# EAGLE schematic Squirco Logic v1.0 (EAGLE 6.5.0)
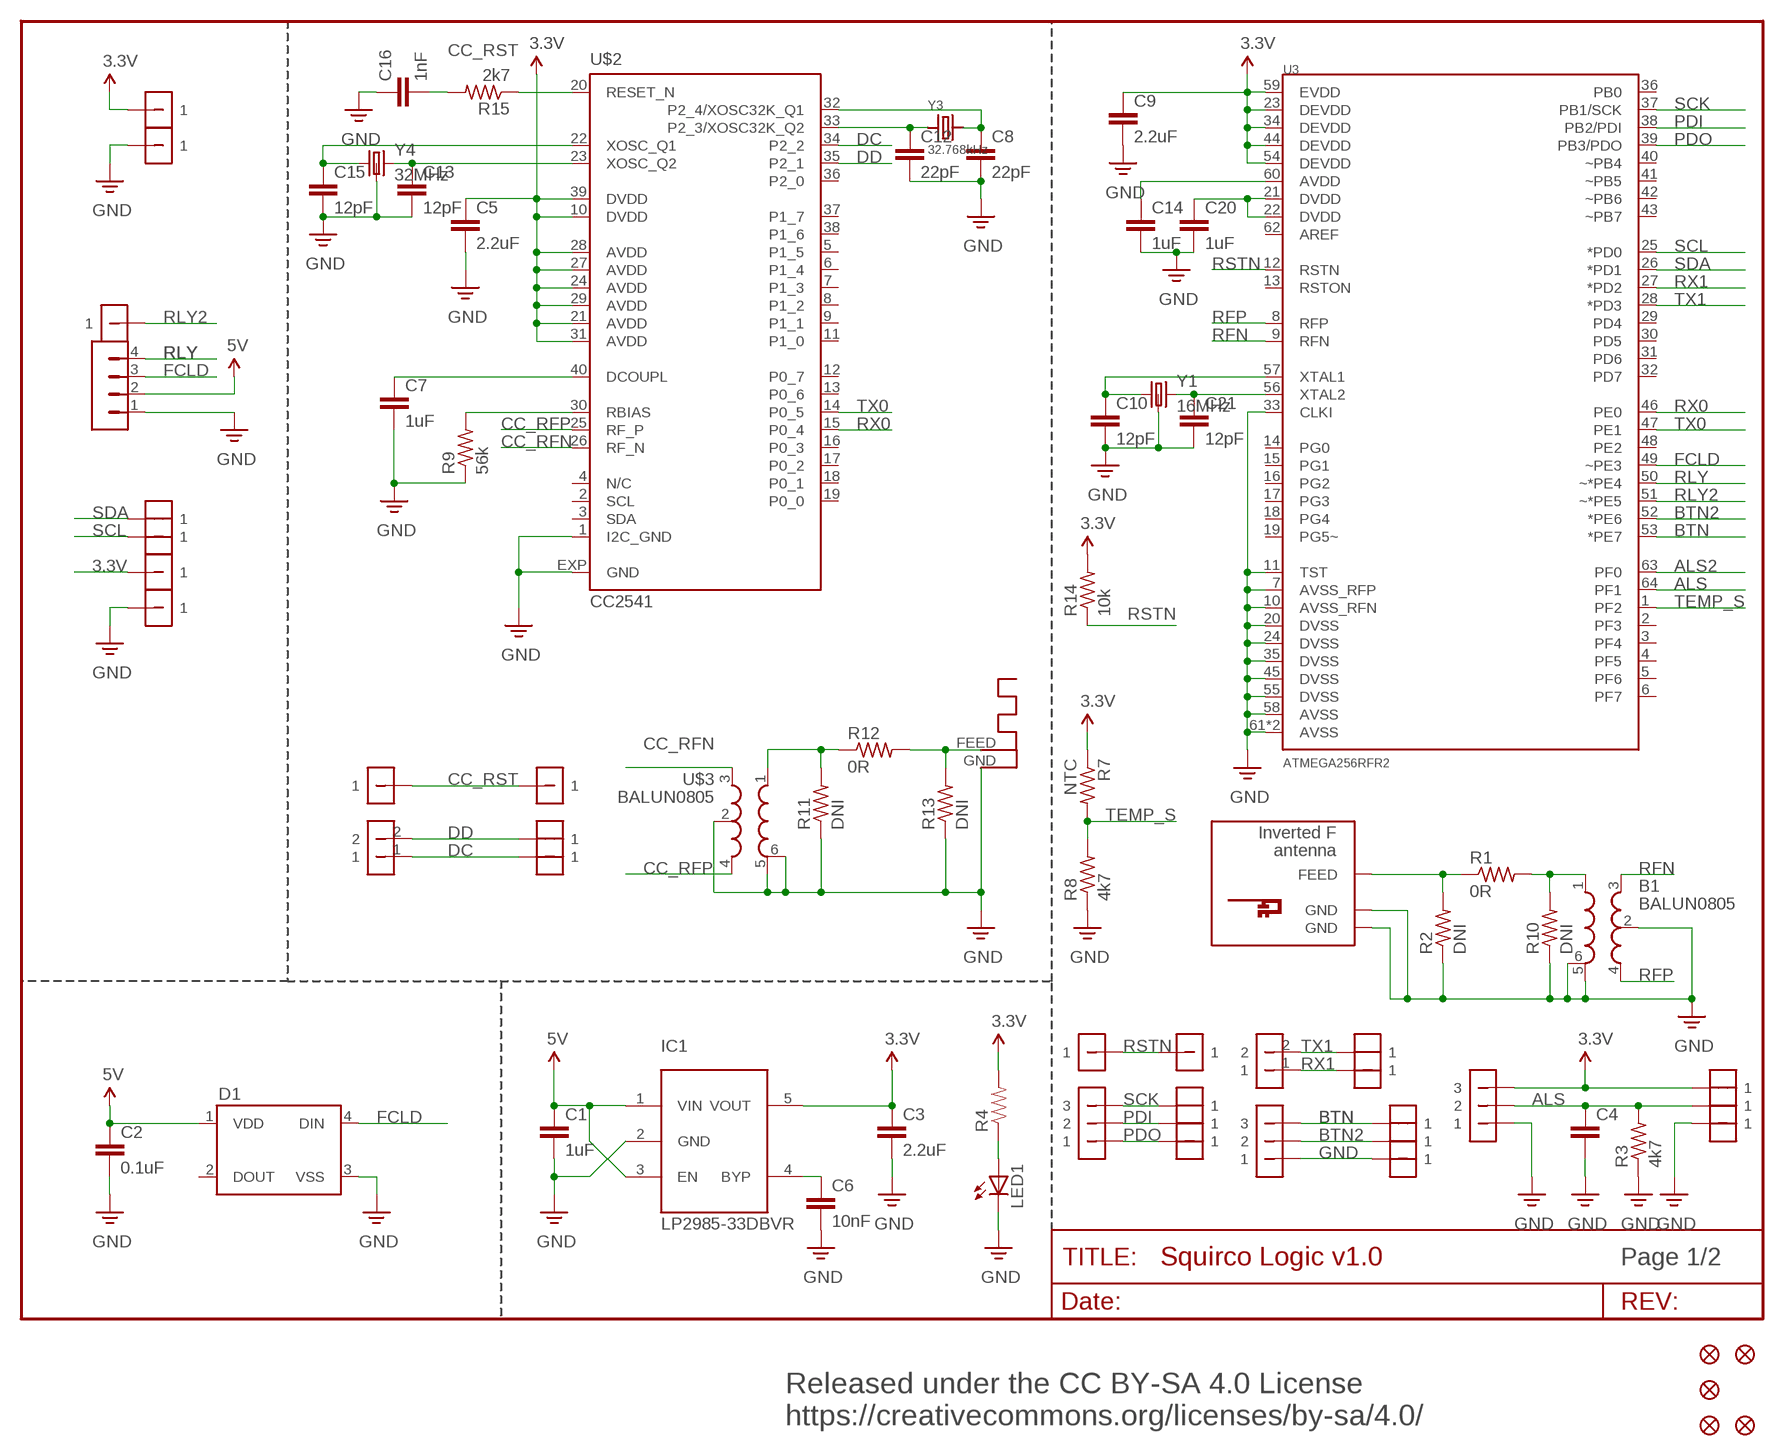
[diagram p0: schematic, sheet 1]

## Parts
ANT1  ANTENNA  [RN-ANT]
B1  BALUN0805  [BALUN-2-4GHZ]
C1  1uF  CAP0603-CAP  [0603-CAP]
C2  0.1uF  CAP0603-CAP  [0603-CAP]
C3  2.2uF  CAP0603-CAP  [0603-CAP]
C4  CAP0603-CAP  [0603-CAP]
C5  2.2uF  CAP0603-CAP  [0603-CAP]
C6  10nF  CAP0603-CAP  [0603-CAP]
C7  1uF  CAP0603-CAP  [0603-CAP]
C8  22pF  CAP0402-CAP  [0402-CAP]
C9  2.2uF  CAP0603-CAP  [0603-CAP]
C10  12pF  CAP0402-CAP  [0402-CAP]
C12  22pF  CAP0402-CAP  [0402-CAP]
C13  12pF  CAP0402-CAP  [0402-CAP]
C14  1uF  CAP0603-CAP  [0603-CAP]
C15  12pF  CAP0402-CAP  [0402-CAP]
C16  1nF  CAP0603-CAP  [0603-CAP]
C20  1uF  CAP0603-CAP  [0603-CAP]
C21  12pF  CAP0402-CAP  [0402-CAP]
D1  WS2812B  [WS2812B]
FID1  FIDUCIALUFIDUCIAL  [MICRO-FIDUCIAL]
FID2  FIDUCIALUFIDUCIAL  [MICRO-FIDUCIAL]
FID3  FIDUCIALUFIDUCIAL  [MICRO-FIDUCIAL]
FID5  FIDUCIALUFIDUCIAL  [MICRO-FIDUCIAL]
FID6  FIDUCIALUFIDUCIAL  [MICRO-FIDUCIAL]
IC1  LP2985-33DBVR  LP298XS  [SOT23-5L]
JP1  M02  [M02]
LED1  LEDCHIP-LED0805  [CHIP-LED0805]
R1  0R  R-US_R0402  [R0402]
R2  DNI  R-US_R0402  [R0402]
R3  4k7  R-US_R0603  [R0603]
R4  RESISTOR0603  [0603-RES]
R7  NTC  R-US_R0402  [R0402]
R8  4k7  R-US_R0603  [R0603]
R9  56k  R-US_R0603  [R0603]
R10  DNI  R-US_R0402  [R0402]
R11  DNI  R-US_R0402  [R0402]
R12  0R  R-US_R0402  [R0402]
R13  DNI  R-US_R0402  [R0402]
R14  10k  R-US_R0603  [R0603]
R15  2k7  R-US_R0603  [R0603]
U3  ATMEGA256RFR2  [QFN-64]
U$1  INVERTED_F_ANTENNA+5  [DN007+5]
U$2  CC2541  [RHA_S-PVQFN-N40]
U$3  BALUN0805  [BALUN-2-4GHZ]
U$4  M03  [M03]
U$5  S04-4MM  [S04-4MM]
U$6  M03  [M03]
U$7  M01  [M01]
U$8  M01  [M01]
U$9  M02  [M02]
U$10  S01C-4MM  [S01C-4MM]
U$11  S01C-4MM  [S01C-4MM]
U$12  S01C-4MM  [S01C-4MM]
U$13  S01C-4MM  [S01C-4MM]
U$14  S01C-4MM  [S01C-4MM]
U$15  S01C-4MM  [S01C-4MM]
U$16  S01C-4MM  [S01C-4MM]
U$17  S01C-4MM  [S01C-4MM]
U$18  S01C-4MM  [S01C-4MM]
U$19  S01C-4MM  [S01C-4MM]
U$20  S01C-4MM  [S01C-4MM]
U$21  S01C-4MM  [S01C-4MM]
U$22  S01C-4MM  [S01C-4MM]
U$23  S01C-4MM  [S01C-4MM]
U$24  S01C-4MM  [S01C-4MM]
U$25  M03  [M03]
U$26  S01C-4MM  [S01C-4MM]
U$27  S01C-4MM  [S01C-4MM]
U$30  S01C-4MM  [S01C-4MM]
U$31  S01C-4MM  [S01C-4MM]
U$32  S01-4MM  [S01-4MM]
U$33  S01-4MM  [S01-4MM]
U$34  S01C-4MM  [S01C-4MM]
Y1  16MHz  CRYSTALABM10  [CRYSTAL-SMD-2.5X2-ABM10]
Y3  32.768kHz  CRYSTAL.ABS07  [ABS07]
Y4  32MHz  CRYSTALABM10  [CRYSTAL-SMD-2.5X2-ABM10]

## Nets
3.3V: C3.1 C5.1 C9.1 IC1.5(VOUT) R4.2 R7.1 R14.2 U3.23(DEVDD) U3.34(DEVDD) U3.44(DEVDD) U3.54(DEVDD) U3.59(EVDD) U$2.10(DVDD) U$2.21(AVDD) U$2.24(AVDD) U$2.27(AVDD) U$2.28(AVDD) U$2.29(AVDD) U$2.31(AVDD) U$2.39(DVDD) U$20.P$1 U$25.3 U$26.P$1 U$30.P$1
5V: C1.1 C2.1 D1.1(VDD) IC1.1(VIN) IC1.3(EN) U$5.2
ALS: C4.1 R3.2 U3.64(PF1) U$25.2 U$31.P$1
ALS2: U3.63(PF0)
BTN: U3.53(*PE7) U$6.3 U$22.P$1
BTN2: U3.52(*PE6) U$6.2 U$23.P$1
CC_RFN: U$2.26(RF_N) U$3.3
CC_RFP: U$2.25(RF_P) U$3.4
CC_RST: C16.2 R15.2 U$8.1 U$17.P$1
DC: U$2.34(P2_2) U$9.1 U$19.P$1
DD: U$2.35(P2_1) U$9.2 U$18.P$1
FCLD: D1.4(DIN) U3.49(~PE3) U$5.3
GND: ANT1.GND B1.2 B1.5 B1.6 C1.2 C2.2 C3.2 C4.2 C5.2 C6.2 C7.2 C8.2 C9.2 C10.2 C12.2 C13.2 C14.2 C15.2 C16.1 C20.2 C21.2 D1.3(VSS) IC1.2(GND) LED1.C R2.1 R3.1 R8.1 R9.1 R10.1 R11.1 R13.1 U3.7(AVSS_RFP) U3.10(AVSS_RFN) U3.11(TST) U3.20(DVSS) U3.24(DVSS) U3.33(CLKI) U3.35(DVSS) U3.45(DVSS) U3.55(DVSS) U3.58(AVSS) U3.61(AVSS) U3.PADDLE(AVSS) U$1.GND U$1.GND@1(GND) U$2.1(I2C_GND) U$2.EXP(GND) U$3.2 U$3.5 U$3.6 U$5.1 U$6.1 U$21.P$1 U$25.1 U$27.P$1 U$32.P$1 U$33.P$1 Y1.P$2(GND) Y1.P$4(GND) Y4.P$2(GND) Y4.P$4(GND)
N$1: C10.1 U3.57(XTAL1) Y1.P$1
N$2: C21.1 U3.56(XTAL2) Y1.P$3
N$3: LED1.A R4.1
N$5: R1.1 R2.2 U$1.FEED
N$6: C6.1 IC1.4(BYP)
N$7: C7.1 U$2.40(DCOUPL)
N$8: C20.1 U3.21(DVDD) U3.22(DVDD)
N$9: C14.1 U3.60(AVDD)
N$11: R9.2 U$2.30(RBIAS)
N$14: R11.2 R12.1 U$3.1
N$15: ANT1.FEED R12.2 R13.2
N$16: C15.1 U$2.22(XOSC_Q1) Y4.P$1
N$18: C13.1 U$2.23(XOSC_Q2) Y4.P$3
N$19: C8.1 U$2.32(P2_4/XOSC32K_Q1) Y3.2
N$20: B1.1 R1.2 R10.2
N$21: C12.1 U$2.33(P2_3/XOSC32K_Q2) Y3.1
N$24: R15.1 U$2.20(RESET_N)
PDI: U3.38(PB2/PDI) U$4.2 U$13.P$1
PDO: U3.39(PB3/PDO) U$4.1 U$14.P$1
RFN: B1.3 U3.9(RFN)
RFP: B1.4 U3.8(RFP)
RLY: U3.50(~*PE4) U$5.4
RLY2: U3.51(~*PE5) U$34.P$1
RSTN: R14.1 U3.12(RSTN) U$7.1 U$11.P$1
RX0: U3.46(PE0) U$2.15(P0_4)
RX1: JP1.1 U3.27(*PD2) U$16.P$1
SCK: U3.37(PB1/SCK) U$4.3 U$12.P$1
SCL: U3.25(*PD0) U$24.P$1
SDA: U3.26(*PD1) U$10.P$1
TEMP_S: R7.2 R8.2 U3.1(PF2)
TX0: U3.47(PE1) U$2.14(P0_5)
TX1: JP1.2 U3.28(*PD3) U$15.P$1
Unconnected: D1.2(DOUT) U3.2(PF3) U3.3(PF4) U3.4(PF5) U3.5(PF6) U3.6(PF7) U3.13(RSTON) U3.14(PG0) U3.15(PG1) U3.16(PG2) U3.17(PG3) U3.18(PG4) U3.19(PG5~) U3.29(PD4) U3.30(PD5) U3.31(PD6) U3.32(PD7) U3.36(PB0) U3.40(~PB4) U3.41(~PB5) U3.42(~PB6) U3.43(~PB7) U3.48(PE2) U3.62(AREF) U$2.2(SCL) U$2.3(SDA) U$2.5(P1_5) U$2.6(P1_4) U$2.7(P1_3) U$2.8(P1_2) U$2.9(P1_1) U$2.11(P1_0) U$2.12(P0_7) U$2.13(P0_6) U$2.16(P0_3) U$2.17(P0_2) U$2.18(P0_1) U$2.19(P0_0) U$2.36(P2_0) U$2.37(P1_7) U$2.38(P1_6)

## Notes on the sheet
- Page 1/2
- Released under the CC BY-SA 4.0 License
  https://creativecommons.org/licenses/by-sa/4.0/

## Power pins joined to a net without a drawn wire
N/C: U$2.4(N/C)

## Library data of the parts
ANT1 = adafruit:ANTENNA
B1 U$3 = Pinoccio2:BALUN: Johanson 2450BM15A001
C1-C10 C12-C16 C20 C21 = SparkFun-Capacitors:CAP: Capacitor Standard 0603 ceramic capacitor, and 0.1" leaded capacitor.
D1 = SparkFun-LED:WS2812B: WS2812B - Intelligent control LED integrated light source Technical Specifications: Power Supply Voltage (VDD): 3.5 to 5.3 V Input Voltage (VI): -0.5 to VDD+0.5 V Operating Junction Temperature (Topt): -25°C to +80°C Storage Temperature Range (Tstg): -55°C to +150°C
FID1-FID3 FID5 FID6 = SparkFun-Aesthetics:FIDUCIAL: Fiducial Alignment Points Various fiducial points for machine vision alignment.
IC1 = adafruit:LP298X
JP1 U$9 = pinhead-half:M02
LED1 = adafruit:LED: LED OSRAM: - CHIPLED LG R971, LG N971, LY N971, LG Q971, LY Q971, LO R971, LY R971 LH N974, LH R974 LS Q976, LO Q976, LY Q976 LO Q996 - Hyper CHIPLED LW Q18S LB Q993, LB Q99A, LB R99A - SideLED LS A670, LO A670, LY A670, LG A670, LP A670 LB A673, LV A673, LT A673, LW A673 LH A674 LY A675 LS A676, LA A676, LO A676, LY A676, LW A676 LS A679, LY A679, LG A679 - Hyper Micro SIDELED® LS Y876, LA Y876, LO Y876, LY Y876 LT Y87S - SmartLED LW L88C, LW L88S LB L89C, LB L89S, LG L890 LS L89K, LO L89K, LY L89K LS L896, LA L896, LO L896, LY L896 - TOPLED LS T670, LO T670, LY T670, LG T670, LP T670 LSG T670, LSP T670, LSY T670, LOP T670, LYG T670 LG T671, LOG T671, LSG T671 LB T673, LV T673, LT T673, LW T673 LH T674 LS T676, LA T676, LO T676, LY T676, LB T676, LH T676, LSB T676, LW T676 LB T67C, LV T67C, LT T67C, LS T67K, LO T67K, LY T67K, LW E67C LS E67B, LA E67B, LO E67B, LY E67B, LB E67C, LV E67C, LT E67C LW T67C LS T679, LY T679, LG T679 LS T770, LO T770, LY T770, LG T770, LP T770 LB T773, LV T773, LT T773, LW T773 LH T774 LS E675, LA E675, LY E675, LS T675 LS T776, LA T776, LO T776, LY T776, LB T776 LHGB T686 LT T68C, LB T68C - Hyper Mini TOPLED® LB M676 - Mini TOPLED Santana® LG M470 LS M47K, LO M47K, LY M47K Source: http://www.osram.convergy.de/
R1-R3 R7-R15 = adafruit:R-US_: RESISTOR, American symbol
R4 = SparkFun-Resistors:RESISTOR: Resistor Basic schematic elements and footprints for 0603, 1206, and PTH resistors.
U3 = Pinoccio:ATMEGA256RFR2
U$1 = DF007:INVERTED_F_ANTENNA: 2.4GHz Inverted F Antenna Based on TI Design Note DN007
U$2 = ST-CC254X:CC2541: CC2541 Bluetooth Smart SoC
U$4 U$6 U$25 = pinhead-half:M03
U$5 = pinhead-half:S04-4MM
U$7 U$8 = pinhead-half:M01
U$10-U$24 U$26 U$27 U$30 U$31 U$34 = pinhead-half:S01C-4MM
U$32 U$33 = pinhead-half:S01-4MM
Y1 Y4 = Pinoccio:CRYSTAL: Crystals Various standard crystals. Proven footprints. Spark Fun Electronics SKU : COM-00534
Y3 = ABRACON:CRYSTAL

## Net classes
1 Tline: width 0.003 mm, drill 0.33 mm
2 120v Mains 5A: clearance 1.27 mm